# Altium schematic sheet RcMPPT-IO.SchDoc: RcMPPT-IO
size A4; DocumentNumber: 4; Revision: 1.0; SheetNumber: 4; SheetTotal: 4
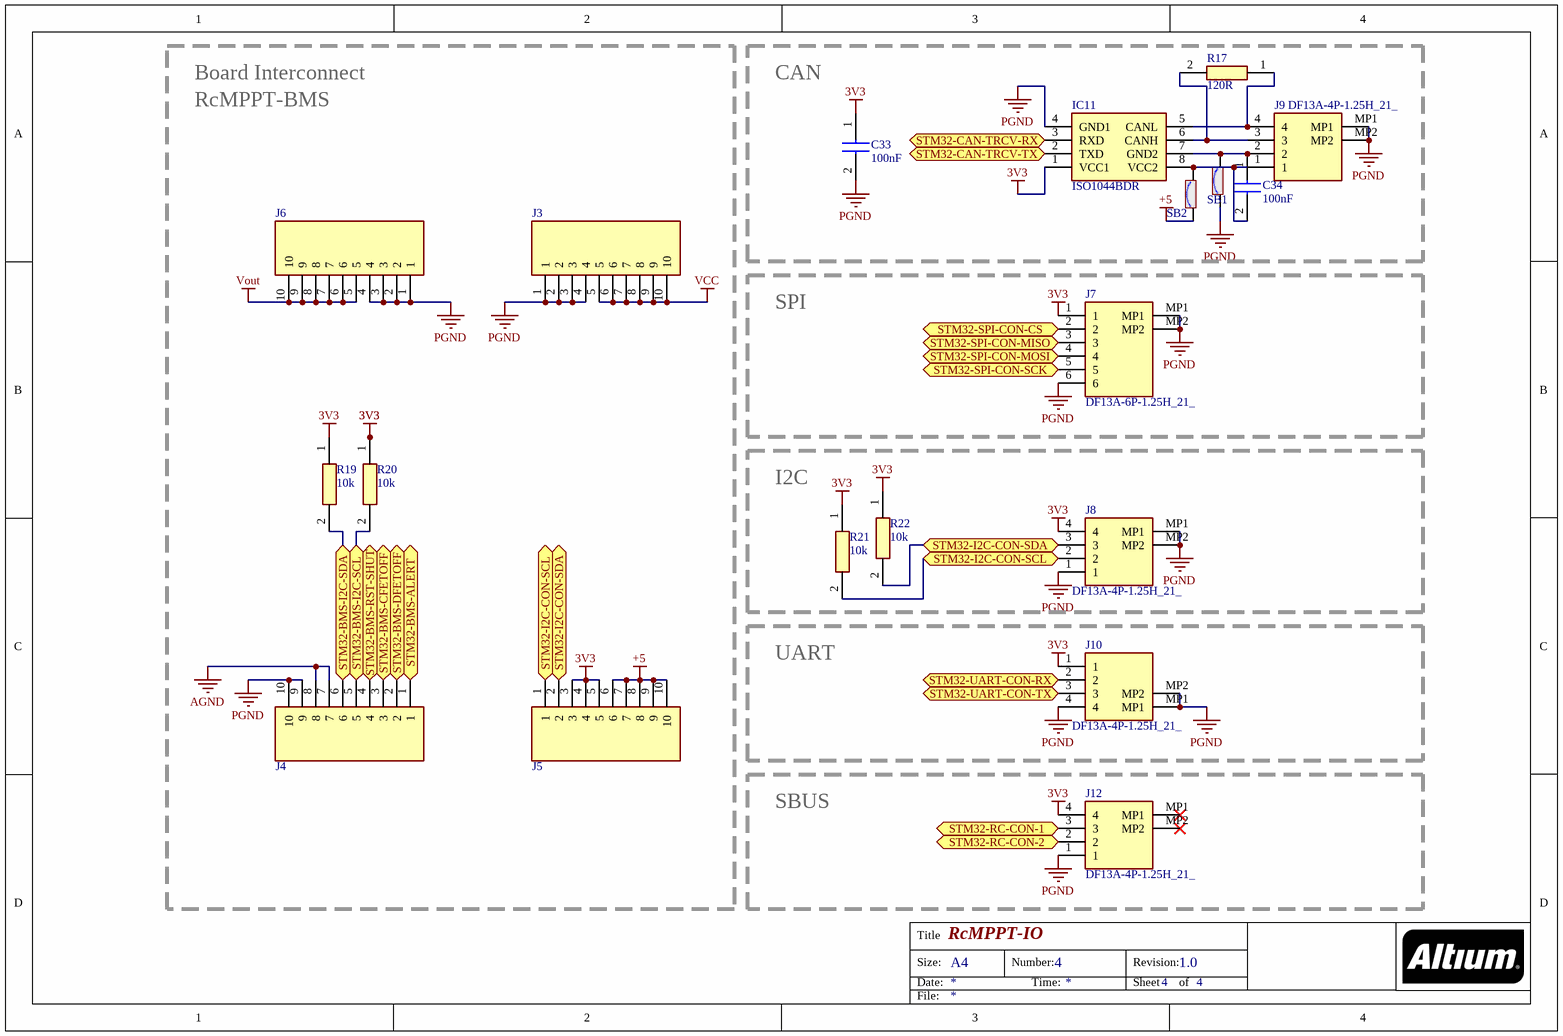
[diagram p0: RcMPPT-IO.SchDoc]

## Parts
C33  100nF  [CAPC1608X97N]
C34  100nF  [CAPC1608X97N]
IC11  ISO1044BDR  [SOIC127P600X175-8N]
J3  M52-040023V1045  [HDRV10W60P0X127_1X10_1270X250X250P]  (value not drawn)
J4  M52-040023V1045  [HDRV10W60P0X127_1X10_1270X250X250P]  (value not drawn)
J5  M52-040023V1045  [HDRV10W60P0X127_1X10_1270X250X250P]  (value not drawn)
J6  M52-040023V1045  [HDRV10W60P0X127_1X10_1270X250X250P]  (value not drawn)
J7  DF13A-6P-1.25H_21_  [DF13A6P125H21]
J8  DF13A-4P-1.25H_21_  [DF13A4P125H21]
J9  DF13A-4P-1.25H_21_  [DF13A4P125H21]
J10  DF13A-4P-1.25H_21_  [DF13A4P125H21]
J12  DF13A-4P-1.25H_21_  [DF13A4P125H21]
R17  120R  [RESC1608X55N]
R19  10k  [RESC1608X55N]
R20  10k  [RESC1608X55N]
R21  10k  [RESC1608X55N]
R22  10k  [RESC1608X55N]
SB1  Solder Bridge  [SOLDER-BRIDGE_R0603-0R]  (value not drawn)
SB2  Solder Bridge  [SOLDER-BRIDGE_R0603-0R]  (value not drawn)

## Blocks framed on the sheet
CAN: C33 C34 IC11 J9 R17 SB1 SB2
SPI: J7
I2C: J8 R21 R22
UART: J10
SBUS: J12

## Ports
STM32-BMS-ALERT (bidir), STM32-BMS-CFETOFF (bidir), STM32-BMS-DFETOFF (bidir), STM32-BMS-I2C-SCL (bidir), STM32-BMS-I2C-SDA (bidir), STM32-BMS-RST-SHUT (bidir), STM32-CAN-TRCV-RX (bidir), STM32-CAN-TRCV-TX (bidir), STM32-I2C-CON-SCL (bidir), STM32-I2C-CON-SDA (bidir), STM32-RC-CON-1 (bidir), STM32-RC-CON-2 (bidir), STM32-SPI-CON-CS (bidir), STM32-SPI-CON-MISO (bidir), STM32-SPI-CON-MOSI (bidir), STM32-SPI-CON-SCK (bidir), STM32-UART-CON-RX (bidir), STM32-UART-CON-TX (bidir)

## Nets
3V3: C33.1 IC11.1(VCC1) J5.3 J5.4 J5.5 J7.1 J8.4 J10.1 J12.4 R19.1 R20.1 R21.1 R22.1
+5: J5.6 J5.7 J5.8 J5.9 J5.10 SB2.1
AGND: J4.7 J4.8
PGND: C33.2 IC11.4(GND1) J3.1 J3.2 J3.3 J3.4 J4.9 J4.10 J6.1 J6.2 J6.3 J6.4 J7.6 J7.MP1 J7.MP2 J8.1 J8.MP1 J8.MP2 J9.MP1 J9.MP2 J10.4 J10.MP1 J10.MP2 J12.1 SB1.1
VCC: J3.5 J3.6 J3.7 J3.8 J3.9 J3.10
Vout: J6.5 J6.6 J6.7 J6.8 J6.9 J6.10
STM32-BMS-ALERT: J4.1 ; port STM32-BMS-ALERT
STM32-BMS-CFETOFF: J4.3 ; port STM32-BMS-CFETOFF
STM32-BMS-DFETOFF: J4.2 ; port STM32-BMS-DFETOFF
STM32-BMS-I2C-SCL: J4.5 R20.2 ; port STM32-BMS-I2C-SCL
STM32-BMS-I2C-SDA: J4.6 R19.2 ; port STM32-BMS-I2C-SDA
STM32-BMS-RST-SHUT: J4.4 ; port STM32-BMS-RST-SHUT
STM32-CAN-TRCV-RX: IC11.3(RXD) ; port STM32-CAN-TRCV-RX
STM32-CAN-TRCV-TX: IC11.2(TXD) ; port STM32-CAN-TRCV-TX
STM32-I2C-CON-SCL: J5.1 J8.2 R21.2 ; port STM32-I2C-CON-SCL
STM32-I2C-CON-SDA: J5.2 J8.3 R22.2 ; port STM32-I2C-CON-SDA
STM32-RC-CON-1: J12.3 ; port STM32-RC-CON-1
STM32-RC-CON-2: J12.2 ; port STM32-RC-CON-2
STM32-SPI-CON-CS: J7.2 ; port STM32-SPI-CON-CS
STM32-SPI-CON-MISO: J7.3 ; port STM32-SPI-CON-MISO
STM32-SPI-CON-MOSI: J7.4 ; port STM32-SPI-CON-MOSI
STM32-SPI-CON-SCK: J7.5 ; port STM32-SPI-CON-SCK
STM32-UART-CON-RX: J10.2 ; port STM32-UART-CON-RX
STM32-UART-CON-TX: J10.3 ; port STM32-UART-CON-TX
NetC34_1: C34.1 IC11.7(GND2) J9.2 SB1.2
NetC34_2: C34.2 IC11.8(VCC2) J9.1 SB2.2
NetIC11_5: IC11.5(CANL) J9.4 R17.1
NetIC11_6: IC11.6(CANH) J9.3 R17.2

Not connected (* = marked no-connect by the designer): J12 MP1* MP2*

## Notes on the sheet
- Board Interconnect
- RcMPPT-BMS
- Title
- Size:
- Date:
- A4
- Number:
- Time:
- Revision:
- Sheet
- of
- File:

## Library data of the parts
C33 C34 = VJ0603Y104JXJAC: Capacitor; Manufacturer_Name: Vishay; Datasheet Link: http://www.vishay.com/docs/45226/vj31xrohsautomlcc.pdf; Height: 0.97mm; Manufacturer_Part_Number: VJ0603Y104JXJAC; Mouser Part Number: 77-VJ0603Y104JXJAC; Mouser Price/Stock: https://www.mouser.com/Search/Refine.aspx?Keyword=77-VJ0603Y104JXJAC
IC11 = ISO1044BDR: Integrated Circuit; Manufacturer_Name: Texas Instruments; Datasheet Link: http://www.ti.com/lit/gpn/iso1044?HQS=ti-null-null-sf-df-pf-sep-wwe&DCM=yes; Height: 1.75mm; Manufacturer_Part_Number: ISO1044BDR; Mouser Part Number: 595-ISO1044BDR; Mouser Price/Stock: https://www.mouser.co.uk/ProductDetail/Texas-Instruments/ISO1044BDR/?qs=DuoOggApuK9UGD9QQWYeTA%3D%3D
J3-J6 = M52-040023V1045: Connector; Manufacturer_Name: Harwin; Datasheet Link: https://componentsearchengine.com/Datasheets/2/M52-040023V1045.pdf; Height: 2.5mm; Manufacturer_Part_Number: M52-040023V1045; Mouser Part Number: 855-M52-040023V1045; Mouser Price/Stock: https://www.mouser.co.uk/ProductDetail/Harwin/M52-040023V1045?qs=wuXwK9wHm9uI6z1%2FRhsKmg%3D%3D
J7 = DF13A-6P-1.25H_21_: Connector; Manufacturer_Name: Hirose; Manufacturer_Part_Number: DF13A-6P-1.25H(21); Datasheet Link: https://www.hirose.com/product/download/?distributor=digikey&type=2d&lang=en&num=DF13A-6P-1.25H(21); Height: 3.75mm; Mouser Part Number: 798-DF13A6P125H21; Mouser Price/Stock: https://www.mouser.co.uk/ProductDetail/Hirose-Connector/DF13A-6P-125H21?qs=XQjbzJWzFPXnreVi%252BPl0Lg%3D%3D; Arrow Part Number: DF13A-6P-1.25H(21); Arrow Price/Stock: https://www.arrow.com/en/products/df13a-6p-1.25h-21/hirose-electric
J8-J10 J12 = DF13A-4P-1.25H_21_: Connector; Manufacturer_Name: Hirose; Manufacturer_Part_Number: DF13A-4P-1.25H(21); Datasheet Link: https://componentsearchengine.com/Datasheets/1/DF13A-4P-1.25H(21).pdf; Height: 3.6mm; Mouser Part Number: 798-DF13A4P125H21; Mouser Price/Stock: https://www.mouser.co.uk/ProductDetail/Hirose-Connector/DF13A-4P-125H21?qs=XQjbzJWzFPXWzMShI70F0w%3D%3D
R17 = ERJPA3J121V: Resistor; Manufacturer_Name: Panasonic; Datasheet Link: https://industrial.panasonic.com/cdbs/www-data/pdf/RDA0000/AOA0000C243.pdf; Height: 0.55mm; Manufacturer_Part_Number: ERJPA3J121V
R19-R22 = MCT06030C1002FP500: Resistor; Manufacturer_Name: Vishay; Datasheet Link: http://www.vishay.com/docs/28705/mcx0x0xpro.pdf; Height: 0.55mm; Manufacturer_Part_Number: MCT06030C1002FP500; Mouser Part Number: 594-MCT06030C1002FP5; Mouser Price/Stock: https://www.mouser.co.uk/ProductDetail/Vishay-Beyschlag/MCT06030C1002FP500?qs=Wvg1umJc15zoHgIjwqoGHw%3D%3D
SB1 SB2 = Solder Bridge: Internal_Part_Number: MCD-00071; Part_Type: Mechanical; Manufacturer_Part_Number: RC0603JR-070RL; Manufacturer: YAGEO; Provided_By: SUBCO; ECCN_US: n/a; ECCN_EU: n/a; Status: Released; Package: SB0603; ComponentLink1Description: Datasheet; ComponentLink1URL: http://tunmcdsvn.tun.st.com/Component_Datasheet_Library/Trunk/Resistors/Yageo_Resistor_RC0603-series